# Altium schematic sheet USB.SchDoc
size A4; SheetNumber: 3; SheetTotal: 6
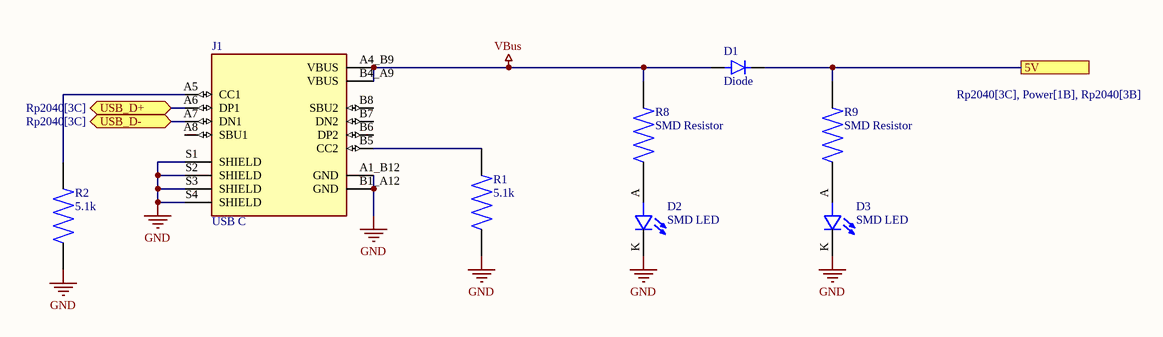
[diagram p0: USB.SchDoc]

## Parts
D1  Diode  [Diode]
D2  SMD LED  [SMD LED]
D3  SMD LED  [SMD LED]
J1  USB C  [USB C]
R1  5.1k  [SMD Resistor]
R2  5.1k  [SMD Resistor]
R8  SMD Resistor  [SMD Resistor]
R9  SMD Resistor  [SMD Resistor]

## Ports
5V (see Rp2040[3C], Power[1B], Rp2040[3B]), USB_D+ (bidir, see Rp2040[3C]), USB_D- (bidir, see Rp2040[3C])

## Nets
GND: D2.K(C) D3.K(C) J1.A1_B12(GND) J1.B1_A12(GND) J1.S1(SHIELD) J1.S2(SHIELD) J1.S3(SHIELD) J1.S4(SHIELD) R1.2 R2.2
VBus: D1.A J1.A4_B9(VBUS) J1.B4_A9(VBUS) R8.1
5V: D1.K R9.1 ; port 5V
USB_D+: J1.A6(DP1) ; port USB_D+
USB_D-: J1.A7(DN1) ; port USB_D-
NetD2_A: D2.A R8.2
NetD3_A: D3.A R9.2
NetJ1_A5: J1.A5(CC1) R2.1
NetJ1_B5: J1.B5(CC2) R1.1

Not connected (* = marked no-connect by the designer): J1 A8(SBU1) B6(DP2) B7(DN2) B8(SBU2)

## Library data of the parts
R1 R2 = SMD Resistor